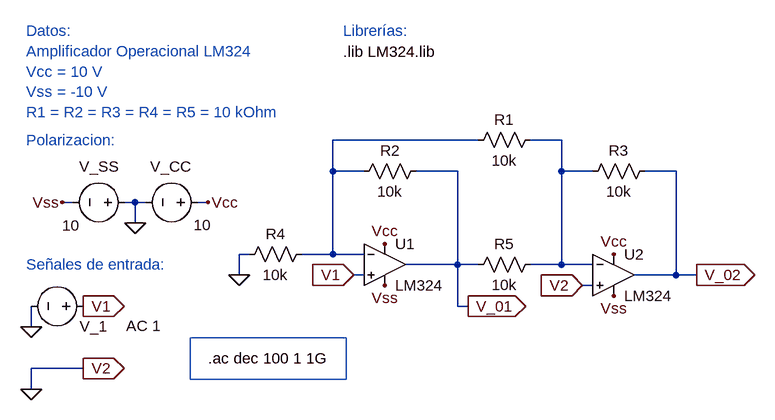
[diagram p0: schematic Lab_1_Circ_1_V1_frec.asc]
Lab_1_Circ_1_V1_frec.asc, the LTspice schematic file:
Version 4
SHEET 1 1560 680
WIRE 96 -208 -128 -208
WIRE 224 -208 176 -208
WIRE -128 -160 -128 -208
WIRE -80 -160 -128 -160
WIRE 64 -160 0 -160
WIRE 224 -160 224 -208
WIRE 272 -160 224 -160
WIRE 400 -160 352 -160
WIRE -528 -112 -544 -112
WIRE -432 -112 -448 -112
WIRE -416 -112 -432 -112
WIRE -320 -112 -336 -112
WIRE -432 -80 -432 -112
WIRE -256 -32 -272 -32
WIRE -128 -32 -128 -160
WIRE -128 -32 -176 -32
WIRE -80 -32 -128 -32
WIRE 64 -16 64 -160
WIRE 64 -16 -16 -16
WIRE 96 -16 64 -16
WIRE 224 -16 224 -160
WIRE 224 -16 176 -16
WIRE 272 -16 224 -16
WIRE -272 0 -272 -32
WIRE -80 0 -96 0
WIRE 400 0 400 -160
WIRE 400 0 336 0
WIRE 432 0 400 0
WIRE 272 16 256 16
WIRE 64 48 64 -16
WIRE 80 48 64 48
WIRE -592 80 -592 48
WIRE -512 144 -592 144
WIRE -592 176 -592 144
FLAG -272 0 0
FLAG -320 -112 Vcc
FLAG -48 -48 Vcc
FLAG 304 -32 Vcc
FLAG -544 -112 Vss
FLAG -48 16 Vss
FLAG 304 32 Vss
FLAG -432 -80 0
FLAG -592 80 0
FLAG -592 176 0
FLAG 80 48 V_01
IOPIN 80 48 Out
FLAG 432 0 V_02
IOPIN 432 0 Out
FLAG -96 0 V1
IOPIN -96 0 In
FLAG 256 16 V2
IOPIN 256 16 In
FLAG -512 48 V1
IOPIN -512 48 Out
FLAG -512 144 V2
IOPIN -512 144 Out
SYMBOL OpAmps\\opamp2 -48 -80 R0
SYMATTR InstName U1
SYMATTR Value LM324
SYMBOL OpAmps\\opamp2 304 -64 R0
SYMATTR InstName U2
SYMATTR Value LM324
SYMBOL res 192 -224 R90
WINDOW 0 0 56 VBottom 2
WINDOW 3 32 56 VTop 2
SYMATTR InstName R1
SYMATTR Value 10k
SYMBOL res 16 -176 R90
WINDOW 0 0 56 VBottom 2
WINDOW 3 32 56 VTop 2
SYMATTR InstName R2
SYMATTR Value 10k
SYMBOL res 368 -176 R90
WINDOW 0 0 56 VBottom 2
WINDOW 3 32 56 VTop 2
SYMATTR InstName R3
SYMATTR Value 10k
SYMBOL res -160 -48 R90
WINDOW 0 0 56 VBottom 2
WINDOW 3 32 56 VTop 2
SYMATTR InstName R4
SYMATTR Value 10k
SYMBOL res 192 -32 R90
WINDOW 0 0 56 VBottom 2
WINDOW 3 32 56 VTop 2
SYMATTR InstName R5
SYMATTR Value 10k
SYMBOL voltage -496 48 M270
WINDOW 0 -31 21 VLeft 2
WINDOW 3 -2 -50 VLeft 2
WINDOW 123 -30 -50 VLeft 2
WINDOW 39 0 0 Left 0
SYMATTR InstName V_1
SYMATTR Value ""
SYMATTR Value2 AC 1
SYMBOL voltage -320 -112 R90
WINDOW 0 -55 25 VRight 2
WINDOW 3 35 -5 VRight 2
WINDOW 123 0 0 Left 0
WINDOW 39 0 0 Left 0
SYMATTR InstName V_CC
SYMATTR Value 10
SYMBOL voltage -432 -112 R90
WINDOW 0 -55 25 VRight 2
WINDOW 3 36 85 VRight 2
WINDOW 123 0 0 Left 0
WINDOW 39 0 0 Left 0
SYMATTR InstName V_SS
SYMATTR Value 10
TEXT -112 -344 Left 2 !.lib LM324.lib
TEXT -112 -376 Left 2 ;Librerías:
TEXT -600 -208 Left 2 ;Polarizacion:
TEXT -600 -16 Left 2 ;Señales de entrada:
TEXT -600 -376 Left 2 ;Datos:\nAmplificador Operacional LM324\nVcc = 10 V\nVss = -10 V\nR1 = R2 = R3 = R4 = R5 = 10 kOhm
TEXT -320 128 Left 2 !.ac dec 100 1 1G
RECTANGLE Normal -107 161 -347 97

The netlist it stands for:
* Lab_1_Circ_1_V1_frec.asc
XU1 V1 N001 Vcc Vss V_01 LM324  ; pins In+ In- V+ V- OUT
XU2 0 N002 Vcc Vss V_02 LM324  ; pins In+ In- V+ V- OUT
R1 N002 N001 10k
R2 V_01 N001 10k
R3 V_02 N002 10k
R4 N001 0 10k
R5 N002 V_01 10k
V_1 V1 0 AC 1
V_CC Vcc 0 10
V_SS 0 Vss 10
.lib LM324.lib
* Librerías:
* Polarizacion:
* Señales de entrada:
* Datos:
* Amplificador Operacional LM324
* Vcc = 10 V
* Vss = -10 V
* R1 = R2 = R3 = R4 = R5 = 10 kOhm
.ac dec 100 1 1G
.backanno
.end